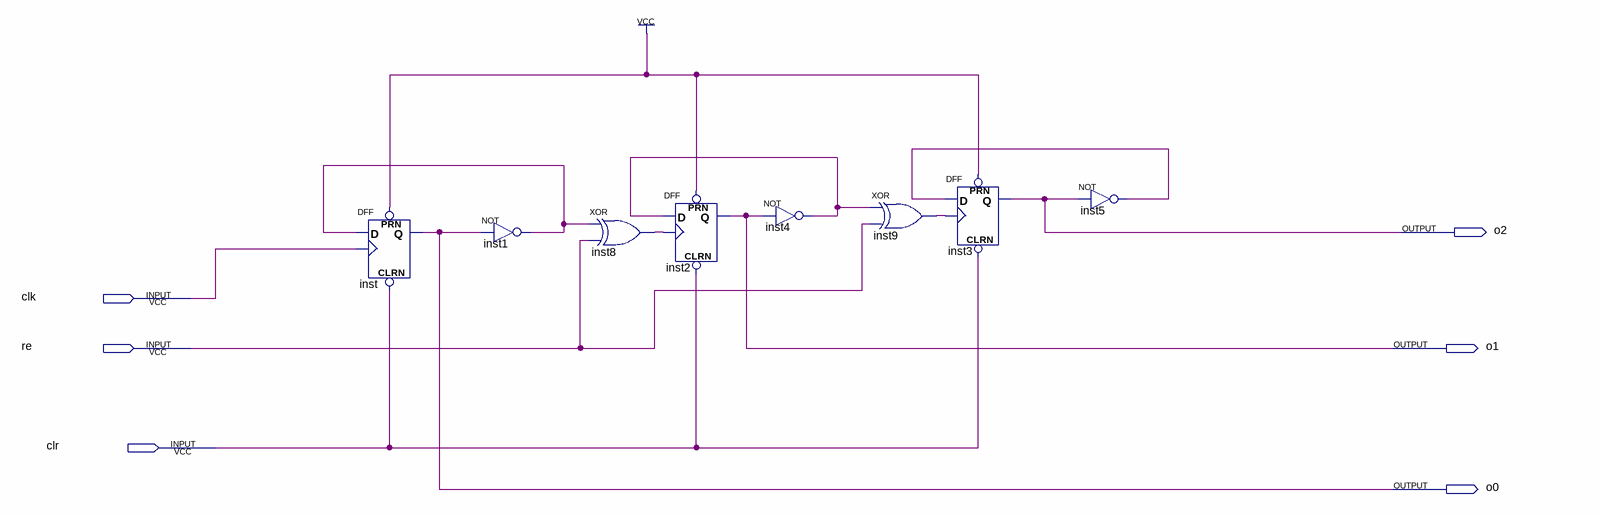
[diagram p0: schematic sheet]
// Quartus schematic 7.bdf as structural Verilog: 8 symbols, 6 pins
module \7  (
  input  clk,
  input  re,
  input  clr,
  output o2,
  output o1,
  output o0
);

  wire inst1_out, inst4_out, inst5_out, inst8_out, inst9_out;

  DFF inst (.CLRN(clr), .CLK(clk), .D(inst1_out), .PRN(1'b1), .Q(o0));
  not inst1 (inst1_out, o0);
  xor inst8 (inst8_out, inst1_out, re);
  DFF inst2 (.CLRN(clr), .CLK(inst8_out), .D(inst4_out), .PRN(1'b1), .Q(o1));
  not inst4 (inst4_out, o1);
  xor inst9 (inst9_out, inst4_out, re);
  DFF inst3 (.CLRN(clr), .CLK(inst9_out), .D(inst5_out), .PRN(1'b1), .Q(o2));
  not inst5 (inst5_out, o2);
endmodule
